# EAGLE design dpsv2 (EAGLE 6.4)
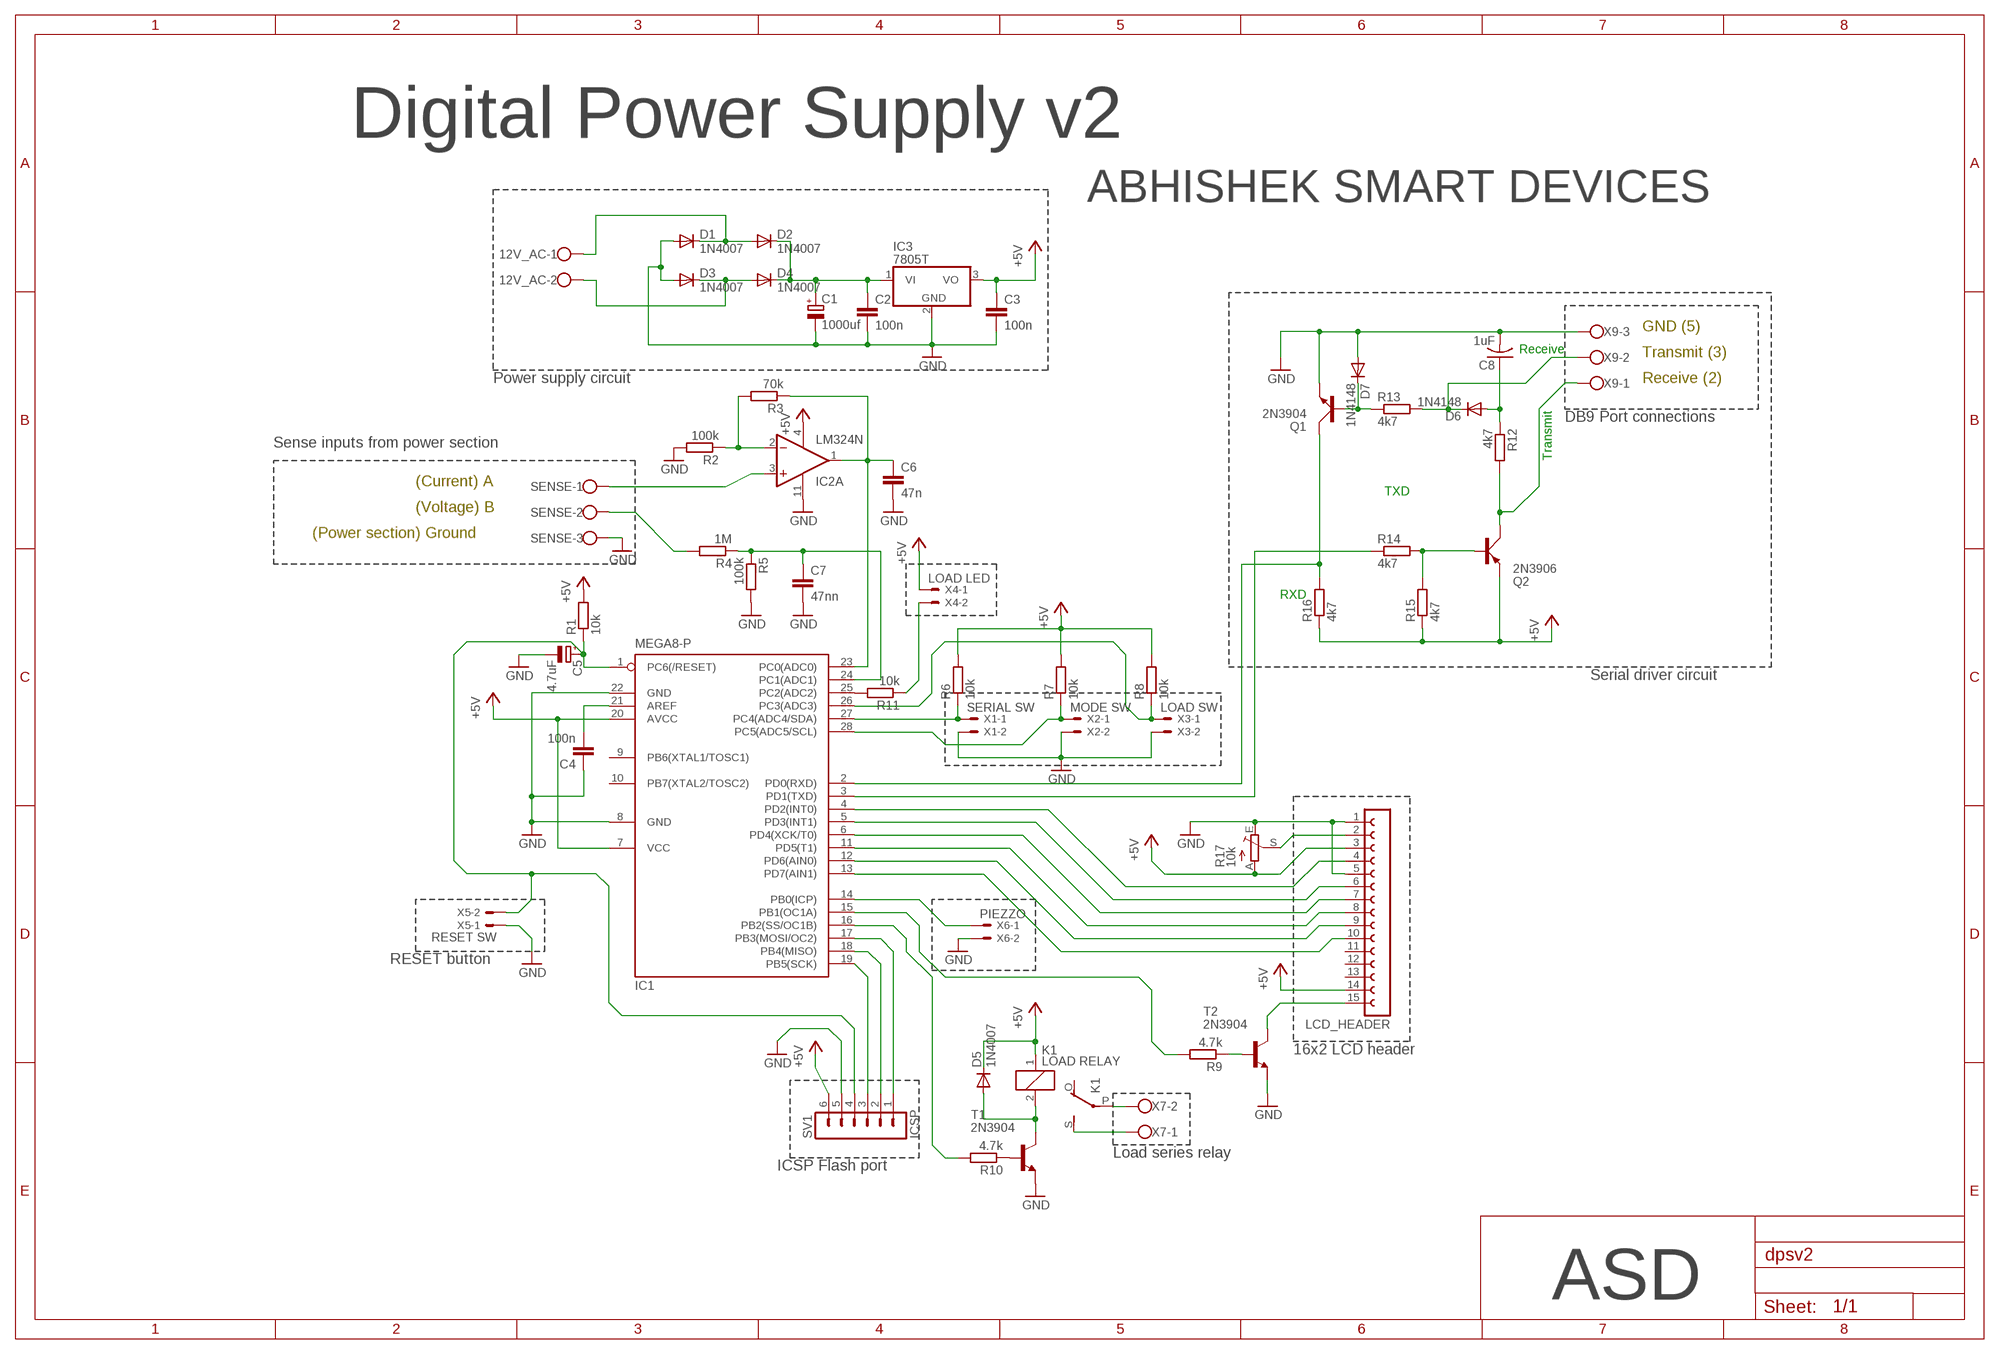
[diagram p0: schematic, sheet 1]

## Parts
12V_AC  W237-102  [W237-102]
C1  1000uf  CPOL-EUE5-13  [E5-13]
C2  100n  C-EU102-054X133  [C102-054X133]
C3  100n  C-EU102-054X133  [C102-054X133]
C4  100n  C-EU102-054X133  [C102-054X133]
C5  4.7uF  CPOL-EUE2.5-7  [E2,5-7]
C6  47n  C-EU050-025X075  [C050-025X075]
C7  47nn  C-EU050-025X075  [C050-025X075]
C8  1uF  C-US025-040X050  [C025-040X050]
D1  1N4007  DIODE-DO07  [DO07]
D2  1N4007  DIODE-DO07  [DO07]
D3  1N4007  DIODE-DO07  [DO07]
D4  1N4007  DIODE-DO07  [DO07]
D5  1N4007  DIODE-DO07  [DO07]
D6  1N4148  [DO35-10]
D7  1N4148  [DO35-10]
IC1  MEGA8-P  [DIL28-3]
IC2  LM324N  [DIL14]
IC3  7805T  [TO220H]
K1  LOAD RELAY  G5L  [G5LE]
LCD_HEADER  FE15-1  [FE15]
Q1  2N3904  [TO92D]
Q2  2N3906  [TO92D]
R1  10k  R-EU_0309/12  [0309/12]
R2  100k  R-EU_0309/12  [0309/12]
R3  70k  R-EU_0309/12  [0309/12]
R4  1M  R-EU_0309/12  [0309/12]
R5  100k  R-EU_0309/12  [0309/12]
R6  10k  R-EU_0309/12  [0309/12]
R7  10k  R-EU_0309/12  [0309/12]
R8  10k  R-EU_0309/12  [0309/12]
R9  4.7k  R-EU_0309/12  [0309/12]
R10  4.7k  R-EU_0309/12  [0309/12]
R11  10k  R-EU_0309/12  [0309/12]
R12  4k7  R-EU_0309/12  [0309/12]
R13  4k7  R-EU_0309/12  [0309/12]
R14  4k7  R-EU_0309/12  [0309/12]
R15  4k7  R-EU_0309/12  [0309/12]
R16  4k7  R-EU_0309/12  [0309/12]
R17  10k  TRIM_EU-B25X  [B25X]
SENSE  W237-103  [W237-103]
SV1  ICSP  MA06-1  [MA06-1]
T1  2N3904  BC548-NPN-TO92-CBE  [TO92-CBE]
T2  2N3904  BC548-NPN-TO92-CBE  [TO92-CBE]
X1  SERIAL SW  22-23-2021  [22-23-2021]
X2  MODE SW  22-23-2021  [22-23-2021]
X3  LOAD SW  22-23-2021  [22-23-2021]
X4  LOAD LED  22-23-2021  [22-23-2021]
X5  RESET SW  22-23-2021  [22-23-2021]
X6  PIEZZO  22-23-2021  [22-23-2021]
X7  W237-102  [W237-102]
X9  W237-103  [W237-103]

## Nets
+5V: C3.1 D5.C IC1.7(VCC) IC1.20(AVCC) IC2.4(P:V+) IC3.3(VO) K1.1 LCD_HEADER.3 LCD_HEADER.14 Q2.E R1.2 R6.2 R7.2 R8.2 R15.1 R16.1 R17.A SV1.6 X4.1
GND: C1.- C2.2 C3.2 C4.1 C5.- C6.2 C7.2 C8.2 D1.A D3.A D7.A IC1.8(GND) IC1.22(GND) IC2.11(P:V-) IC3.2(GND) LCD_HEADER.1 LCD_HEADER.5 Q1.E R2.2 R5.2 R17.E SENSE.3 SV1.5 T1.E T2.E X1.2 X2.2 X3.2 X5.1 X6.2 X9.3
N$1: C6.1 IC1.23(PC0(ADC0)) IC2.1(A:OUT) R3.1
N$2: 12V_AC.1 D1.C D2.A
N$3: 12V_AC.2 D3.C D4.A
N$4: C1.+ C2.1 D2.C D4.C IC3.1(VI)
N$5: IC2.3(A:+IN) SENSE.1
N$6: R4.2 SENSE.2
N$7: C4.2 IC1.21(AREF)
N$8: C7.1 IC1.24(PC1(ADC1)) R4.1 R5.1
N$9: C5.+ IC1.1(PC6(/RESET)) R1.1 SV1.4 X5.2
N$10: IC2.2(A:-IN) R2.1 R3.2
N$11: IC1.27(PC4(ADC4/SDA)) R6.1 X1.1
N$12: IC1.28(PC5(ADC5/SCL)) R7.1 X2.1
N$13: IC1.26(PC3(ADC3)) R8.1 X3.1
N$14: LCD_HEADER.15 T2.C
N$15: IC1.15(PB1(OC1A)) R9.2
N$16: IC1.16(PB2(SS/OC1B)) R10.2
N$17: R9.1 T2.B
N$18: R10.1 T1.B
N$19: D5.A K1.2 T1.C
N$20: IC1.14(PB0(ICP)) X6.1
N$21: K1.P(2:P) X7.2
N$22: IC1.25(PC2(ADC2)) R11.2
N$23: R11.1 X4.2
N$24: K1.S(2:S) X7.1
N$25: IC1.17(PB3(MOSI/OC2)) SV1.1
N$26: IC1.18(PB4(MISO)) SV1.2
N$27: IC1.19(PB5(SCK)) SV1.3
N$28: IC1.2(PD0(RXD)) Q1.C R16.2
N$29: Q2.B R14.2 R15.2
N$30: C8.1 D6.A R12.1
N$31: Q2.C R12.2 X9.1
N$32: D7.C Q1.B R13.1
N$33: D6.C R13.2 X9.2
N$34: IC1.5(PD3(INT1)) LCD_HEADER.6
N$35: IC1.3(PD1(TXD)) R14.1
N$36: LCD_HEADER.2 R17.S
N$37: IC1.6(PD4(XCK/T0)) LCD_HEADER.7
N$38: IC1.11(PD5(T1)) LCD_HEADER.8
N$39: IC1.12(PD6(AIN0)) LCD_HEADER.9
N$40: IC1.4(PD2(INT0)) LCD_HEADER.4
N$41: IC1.13(PD7(AIN1)) LCD_HEADER.10
Unconnected: IC1.9(PB6(XTAL1/TOSC1)) IC1.10(PB7(XTAL2/TOSC2)) IC2.5(B:+IN) IC2.6(B:-IN) IC2.7(B:OUT) IC2.8(C:OUT) IC2.9(C:-IN) IC2.10(C:+IN) IC2.12(D:+IN) IC2.13(D:-IN) IC2.14(D:OUT) K1.O(2:O) LCD_HEADER.11 LCD_HEADER.12 LCD_HEADER.13

## Notes on the sheet
- Digital Power Supply v2
- ABHISHEK SMART DEVICES
- GND (5)
- Receive
- Transmit (3)
- Power supply circuit | Receive (2)
- DB9 Port connections
- Sense inputs from power section
- Transmit
- (Current) A | TXD
- (Voltage) B
- (Power section) Ground
- RXD
- Serial driver circuit
- RESET button
- 16x2 LCD header
- Load series relay
- ICSP Flash port
- ASD

## Library data of the parts
12V_AC X7 = con-wago-500:W237-102: WAGO SCREW CLAMP; MPN: 237-102; OC_FARNELL: unknown; OC_NEWARK: 70K9898
C1 C5 = resistor:CPOL-EU: POLARIZED CAPACITOR, European symbol
C2-C4 C6 C7 = resistor:C-EU: CAPACITOR, European symbol
C8 = resistor:C-US: CAPACITOR, American symbol
D1-D5 = diode:DIODE-: DIODE
D6 D7 = diode:1N4148: DIODE high speed (Philips)
IC1 = atmel:MEGA8-P: MICROCONTROLLER 8 Kbytes FLASH, 1 kbytes SRAM, 512 bytes EEPROM, USART, 4-channel 10 bit ADC, 2-channel 8 bit ADC Pin compatible with Atmega48, ATMega88, ATMega168 Source: avr.lbr; OC_FARNELL: unknown; OC_NEWARK: unknown
IC2 = linear:LM324: OP AMP
IC3 = linear:78*: Positive VOLTAGE REGULATOR Source: http://cache.national.com/ds/LM/LM78L05.pdf http://www.fairchildsemi.com/ds/LM/LM7805.pdf
K1 = relay:G5L: RELAY 1 x switch, 10 A/120 V AC, 8 A/30 V ADC, Omron; OC_FARNELL: unknown; OC_NEWARK: unknown
LCD_HEADER = con-lsta:FE15-1: FEMALE HEADER; OC_FARNELL: unknown; OC_NEWARK: unknown
Q1 = transistor-small-signal:2N3904: NPN TRANSISTOR
Q2 = transistor-small-signal:2N3906: PNP TRANSISTOR
R1-R16 = resistor:R-EU_: RESISTOR, European symbol
R17 = pot:TRIM_EU-: POTENTIOMETER
SENSE X9 = con-wago-500:W237-103: WAGO SCREW CLAMP; MPN: 237-103; OC_FARNELL: unknown; OC_NEWARK: 18M7116
SV1 = con-lstb:MA06-1: PIN HEADER; OC_FARNELL: unknown; OC_NEWARK: unknown
T1 T2 = transistor:*-NPN-: NPN Transistror BF959 corrected 2008.03.06
X1-X6 = con-molex:22-23-2021: .100" (2.54mm) Center Header - 2 Pin; MF: MOLEX; MPN: 22-23-2021; OC_FARNELL: 1462926; OC_NEWARK: 25C3832

## Board
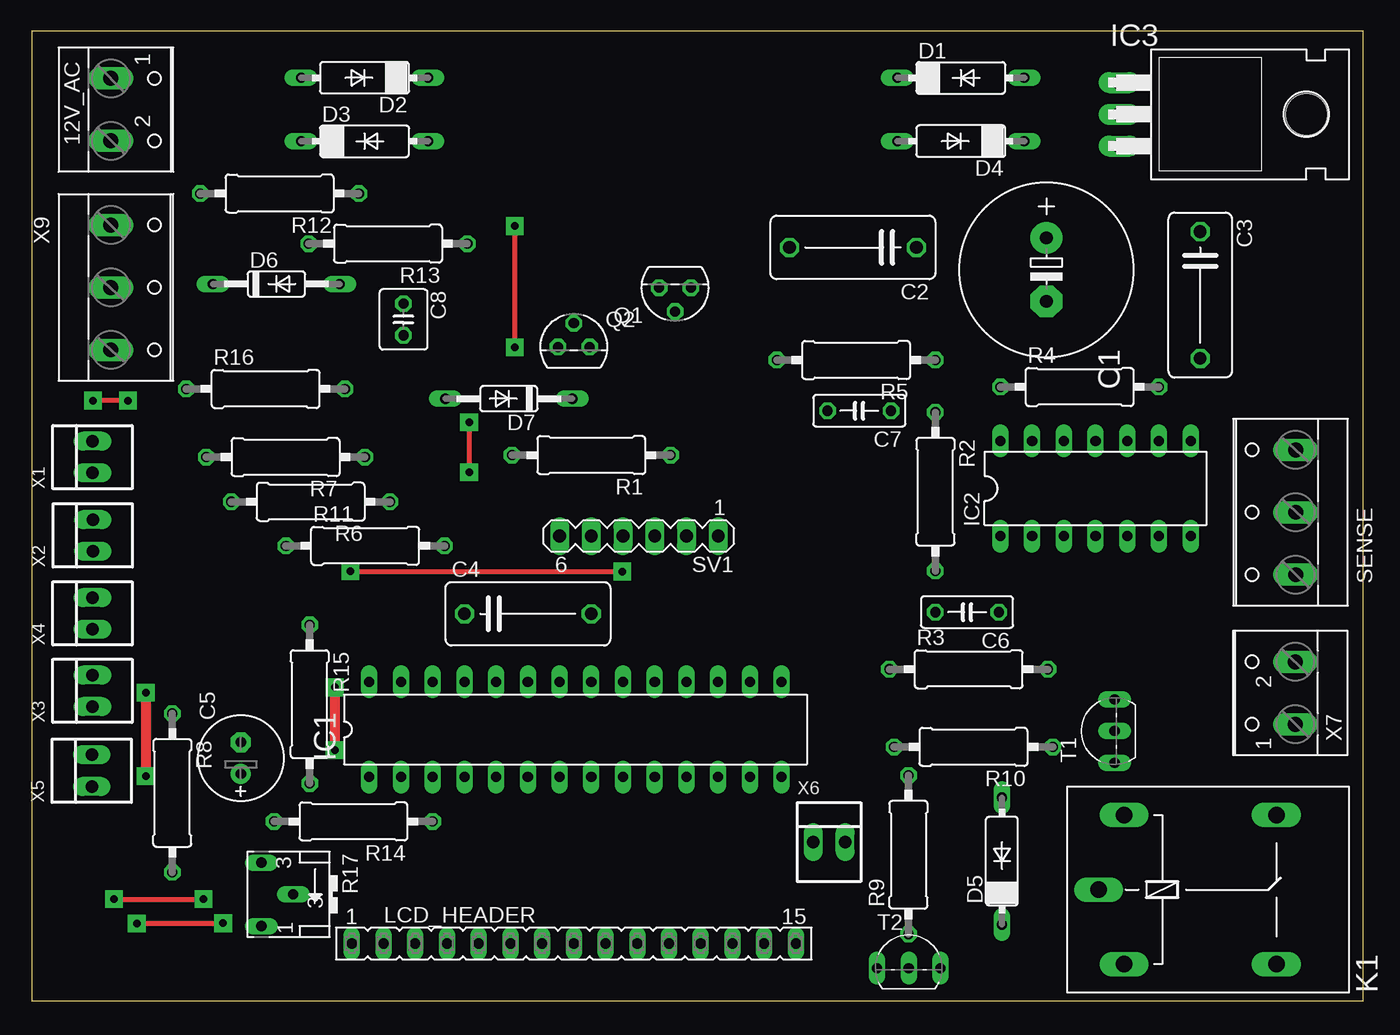
[diagram p1: board, top side]
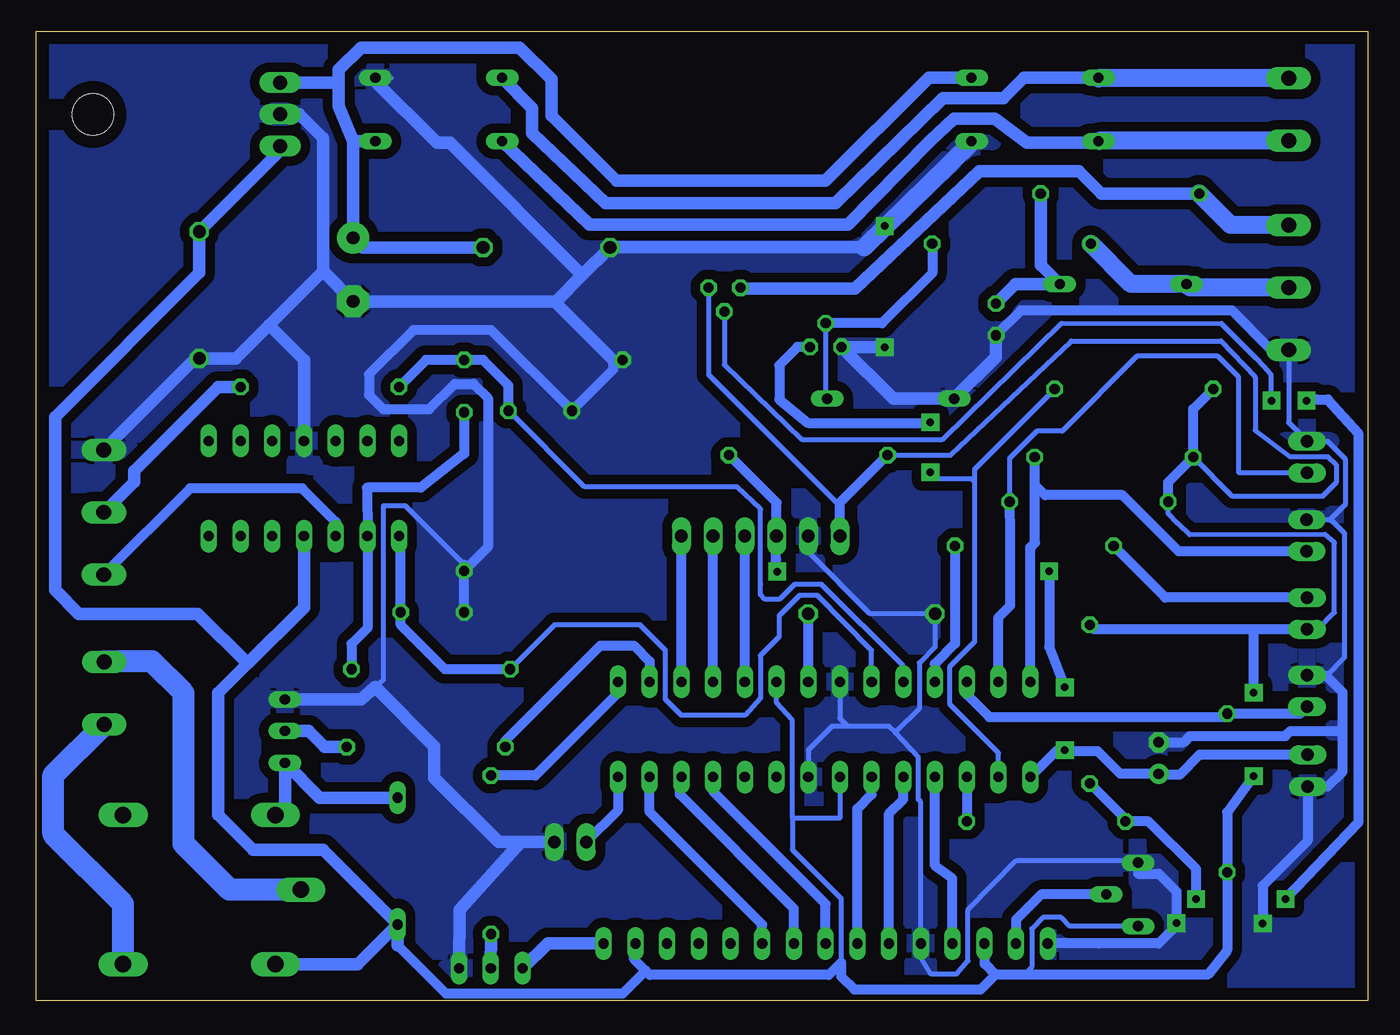
[diagram p2: board, bottom side, seen from below]

Size 106.66 x 77.65 mm. Coordinates in mm from the lower left corner, seen from the top.
Outline: 0,0 106.66,0 106.66,77.65 0,77.65 0,0
Copper layers (1*16): Top 0.035mm / dielectric 1.5mm / Bottom 0.035mm
Design rules "default *": minimum track width 10mil, minimum drill 24mil, track to track 30mil, track to pad 30mil, pad to pad 8mil, via to via 8mil, smd to smd 8mil, copper to edge 40mil, drill to drill 8mil, minimum pad ring 10mil, minimum via ring 8mil, stop-mask expansion 4mil, vias tented up to drill 0mil, thermal gap 10mil

### Footprints (pad centres in the part's own frame; a part is rotated, then mirrored left to right if it is on the bottom)
W237-102 = drill 1.194 long: 1 -2.5,-1.27; 2 2.5,-1.27
E5-13 = drill 1.016 pad 2.54: + -2.54,0 | drill 1.016 pad 2.54 octagon: - 2.54,0
C102-054X133 = drill 1.016 octagon: 1 -5.08,0; 2 5.08,0
E2,5-7 = drill 0.813 pad 1.6: + -1.27,0 | drill 0.813 pad 1.6 octagon: - 1.27,0
C050-025X075 = drill 0.813 octagon: 1 -2.54,0; 2 2.54,0
C025-040X050 = drill 0.813 octagon: 1 -1.27,0; 2 1.27,0
DO07 = drill 0.813 long: A 5.08,0; C -5.08,0
DO35-10 = drill 0.813 long: A 5.08,0; C -5.08,0
DIL28-3 = drill 0.813 long: 1 -16.51,-3.81; 2 -13.97,-3.81; 3 -11.43,-3.81; 4 -8.89,-3.81; 5 -6.35,-3.81; 6 -3.81,-3.81; 7 -1.27,-3.81; 8 1.27,-3.81; 9 3.81,-3.81; 10 6.35,-3.81; 11 8.89,-3.81; 12 11.43,-3.81; 13 13.97,-3.81; 14 16.51,-3.81; 15 16.51,3.81; 16 13.97,3.81; 17 11.43,3.81; 18 8.89,3.81; 19 6.35,3.81; 20 3.81,3.81; 21 1.27,3.81; 22 -1.27,3.81; 23 -3.81,3.81; 24 -6.35,3.81; 25 -8.89,3.81; 26 -11.43,3.81; 27 -13.97,3.81; 28 -16.51,3.81
DIL14 = drill 0.813 long: 1 -7.62,-3.81; 2 -5.08,-3.81; 3 -2.54,-3.81; 4 0,-3.81; 5 2.54,-3.81; 6 5.08,-3.81; 7 7.62,-3.81; 8 7.62,3.81; 9 5.08,3.81; 10 2.54,3.81; 11 0,3.81; 12 -2.54,3.81; 13 -5.08,3.81; 14 -7.62,3.81
TO220H = drill 1.118 long: 1 -2.54,-10.16; 2 0,-10.16; 3 2.54,-10.16 | hole 3.302: 0,4.826
G5LE = drill 1.321 long: 1 -7.493,-5.969; 2 -7.493,5.969; O 4.699,5.969; P -9.525,0; S 4.699,-5.969
FE15 = drill 0.813 long: 1 -17.78,0; 2 -15.24,0; 3 -12.7,0; 4 -10.16,0; 5 -7.62,0; 6 -5.08,0; 7 -2.54,0; 8 0,0; 9 2.54,0; 10 5.08,0; 11 7.62,0; 12 10.16,0; 13 12.7,0; 14 15.24,0; 15 17.78,0
TO92D = drill 0.813 octagon: B 0,1.905; C 1.27,0; E -1.27,0
0309/12 = drill 0.813 octagon: 1 -6.35,0; 2 6.35,0
B25X = drill 0.813 long: A 2.54,-1.905; E -2.54,-1.905; S 0,0.635
W237-103 = drill 1.194 long: 1 -5,-1.29; 2 0,-1.29; 3 5,-1.29
MA06-1 = drill 1.016 long: 1 -6.35,0; 2 -3.81,0; 3 -1.27,0; 4 1.27,0; 5 3.81,0; 6 6.35,0
TO92-CBE = drill 0.813 long: B 0,0; C -2.54,0; E 2.54,0
22-23-2021 = drill 1 long: 1 -1.27,0; 2 1.27,0

### Placement (x,y rotation side)
12V_AC  7.62,71.37 270 top
C1  81.28,58.55 270 top
C2  65.79,60.33 180 top
C3  93.6,56.52 270 top
C4  39.75,30.99 0 top
C5  16.76,19.43 90 top
C6  74.93,31.12 180 top
C7  66.29,47.24 180 top
C8  29.79,54.56 270 top
D1  74.42,73.91 0 top
D2  26.67,73.91 180 top
D3  26.67,68.83 0 top
D4  74.42,68.83 180 top
D5  77.72,11.18 90 top
D6  19.61,57.4 0 top
D7  38.23,48.21 180 top
IC1  43.56,21.72 0 top
IC2  85.22,41.02 0 top
IC3  97.28,70.99 270 top
K1  95,8.89 0 top
LCD_HEADER  43.43,4.57 0 top
Q1  43.43,52.35 0 top
Q2  51.54,57.1 180 top
R1  44.83,43.69 180 top
R2  72.39,40.77 270 top
R3  75.06,26.54 0 top
R4  83.95,49.15 0 top
R5  66.04,51.31 180 top
R6  22.35,39.95 180 top
R7  20.35,43.54 180 top
R8  11.28,16.64 270 top
R9  70.23,11.68 90 top
R10  75.44,20.32 180 top
R11  26.72,36.42 0 top
R12  19.86,64.64 180 top
R13  28.55,60.63 180 top
R14  25.78,14.35 180 top
R15  22.28,23.75 270 top
R16  18.75,49 0 top
R17  20.32,8.51 270 top
SENSE  99.95,39.12 90 top
SV1  48.64,37.21 180 top
T1  86.74,21.59 90 top
T2  70.26,2.59 0 top
X1  4.88,43.54 90 top
X2  4.9,37.26 90 top
X3  4.88,24.82 90 top
X4  4.88,31.01 90 top
X5  4.83,18.41 90 top
X6  63.88,12.7 0 top
X7  99.95,24.64 90 top
X9  7.65,57.12 270 top

### Tracks (layer width: path | path; a pad name or v marks a point on that pad's centre or on a via)
+5V  (via drill 0.6 pad 1.42)
  Top 0.813: v9.14,24.66 v9.14,17.98
  Bottom 0.406: IC3.3 87.12,68.07 | IC1.7 42.29,14.61 46.1,14.61 | 46.1,14.61 46.1,22.48 47.37,23.88 IC1.20 | 42.29,39.88 42.29,39.62 52.81,50.14 Q2.E | 21.92,29.74 R15.1 | X4.1 4.04,29.74 2.69,31.09 2.69,36.68 3.45,37.34 14.27,37.31 15.21,38.23 16,39.01 R6.2 | R1.2 33.43,43.69 23.77,52.83 11.79,52.83 9.04,49.94 9.04,45.67 6.25,43.56 3.2,43.56 2.54,42.93 2.54,41.5 3.66,40.39 10.85,40.39 R7.2 | 30.68,4.52 LCD_HEADER.3 | R17.A 23.88,5.97 24.56,6.66 26.03,6.66 26.92,5.77 26.92,2.69 27.53,2.08 | 46.1,14.61 46.1,12.09 42.19,8.18 42.19,3.05 | 58.78,4.47 LCD_HEADER.14
  Bottom 0.813: SV1.6 42.29,39.62 | 42.29,39.88 R1.2 | R16.1 13.99,47.4 R7.2 16,41.53 R6.2 | X4.1 9.14,29.74 | 9.14,29.74 21.92,29.74 | v9.14,17.98 11.28,15.09 R8.2 11.28,4.04 12.83,2.08 27.53,2.08 29.82,2.08 | v9.14,24.66 9.14,29.74 | 30.68,4.52 30.68,2.95 29.82,2.08 | 57.85,2.4 57.51,2.06 43.18,2.06 42.19,3.05 42.19,1.93 41.15,0.89 31.01,0.89 29.82,2.08 | 57.85,2.4 58.78,3.33 58.78,4.47 | 77.72,4.45 73.86,0.58 59.66,0.58 57.85,2.4
  Bottom 1.016: 87.12,68.07 C3.1 93.6,58.29 105.16,46.74 105.16,32.89 103.25,30.99 93.73,30.99 89.73,26.99 | IC2.4 85.22,31.5 89.73,26.99 | 89.73,26.99 92.07,24.64 92.07,14.86 89.28,12.06 83.69,12.06 D5.C | K1.1 80.9,2.92 D5.C | D5.C 77.72,4.45
GND  (via drill 0.6 pad 1.42)
  Top 0.406: v8.43,6.17 v15.34,6.2 | v38.71,52.32 v38.71,62.04
  Bottom 0.406: 78.23,73.91 D1.A 79.5,73.66 | 65.15,56.01 65.02,56.01 | C3.2 93.92,51.44 | R5.2 60.45,51.31 | C6.2 R2.2 | 72.39,34.93 77.09,39.62 78.87,39.62 78.87,25.65 79.5,25.11 | 37.85,21.46 36.02,19.53 36.02,16.1 35.81,15.9 LCD_HEADER.5 35.81,3.4 35.05,2.16 32.92,2.16 32.03,3.17 32.03,7.29 28.14,11.23 18.59,11.23 R17.E | 37.85,21.46 38.35,21.97 41.66,21.97 | 41.66,21.97 42.93,21.97 44.83,20.07 IC1.8 | IC1.22 42.29,22.61 41.66,21.97 | SV1.5 44.83,35.94 39.88,30.99 C4.1 34.67,28.32 35.94,27.05 35.94,23.37 37.85,21.46 | 4.8,26.01 X3.2 | 3.05,38.51 1.83,39.73 1.83,43.38 3.25,44.81 X1.2 6.35,46.28 X9.3 | 3.05,38.51 4.88,38.51 X2.2 | 21.49,4.52 21.54,4.57 | 3.05,38.51 2.95,38.51 1.88,37.44 1.88,27.48 3.35,26.01 | 2.34,21.59 2.03,21.9 | D3.A 31.75,68.73 | 60.53,60.35 C2.2 | 38.84,52.35 v38.71,52.32 | 38.56,62.09 v38.71,62.04 39.63,61.11 39.73,61.11 40.34,60.5 40.34,60.35 | v15.34,6.2 15.34,5.99
  Bottom 0.813: 60.45,51.31 60.45,50.55 C7.2 70.23,53.72 76.45,53.72 80.01,50.16 80.01,48.51 78.87,47.37 75.18,47.37 73.15,49.4 71.63,49.4 70.48,48.26 70.48,36.32 R2.2 | C6.2 72.39,34.93 | R17.E 18.41,10.16 16.76,10.16 15.34,8.74 v15.34,6.2 | LCD_HEADER.1 21.54,4.57 16.76,4.57 15.34,5.99 | 4.8,26.01 3.35,26.01 2.03,24.69 2.03,21.9 2.03,18.34 3.23,17.15 X5.1 4.83,12.8 8.43,9.2 v8.43,6.17 | C5.- 14.76,20.7 14.27,21.18 6.6,21.18 6.2,21.59 2.34,21.59 | X9.3 7.72,52.12 10.87,55.27 27.81,55.27 C8.2
  Bottom 1.016: IC3.2 85.6,70.99 83.69,69.09 83.69,58.42 | 83.69,58.42 C1.- 65.15,56.01 60.45,51.31 | 65.02,56.01 62.93,58.1 | 62.93,58.1 C2.2 | 79.5,73.66 74.55,68.71 73.53,68.71 62.93,58.1 | C3.2 90.68,51.44 88.01,54.1 | 88.01,54.1 83.69,58.42 | 93.92,51.44 SENSE.3 | X6.2 67.82,12.7 | 67.82,12.7 72.77,7.26 T2.E | IC2.11 85.22,51.31 88.01,54.1 | T1.E 80.64,24.13 79.5,25.11 74.78,20.38 74.78,17.83 69.65,12.7 67.82,12.7 | 40.34,60.35 60.53,60.35 | C8.2 29.79,51.56 D7.A 38.02,48.21 Q1.E 38.84,52.35
  Bottom 1.422: 31.75,68.73 40.34,60.35
  pour Bottom: -1.02,78.13 -1.02,-0.61 -0.33,-1.3 107.26,-1.3 108.92,0.36 108.92,77.32 106.73,79.5 0.36,79.5 -0.97,78.18
N$1
  Bottom 0.406: 77.47,37.08 IC2.1 | IC1.23 39.75,28.07 44.09,32.46 45.52,32.46 47.17,30.81 47.17,29.13 48.67,27.63 48.67,24.28 48.64,24.26 49.91,22.86 54.99,22.86 56.26,24.13 56.26,28.07 58.29,30.1 65.15,30.1 R3.1
  Bottom 0.813: 77.47,37.08 C6.1 77.47,30.1 73.91,26.54 R3.1
N$2
  Bottom 0.406: 21.59,73.87 D2.A
  Bottom 1.016: D2.A 27.56,73.91 29.21,72.26 34.04,72.26 42.65,63.88 61.06,63.88 66.93,69.47 66.93,71.5 D1.C
  Bottom 1.422: 12V_AC.1 21.59,73.87
N$3
  Bottom 0.406: 21.55,68.87 D3.C 21.72,68.71
  Bottom 1.016: 21.72,68.71 27.3,68.71 29.9,70.64 33.17,70.64 35.03,68.86 37.39,66.5 41.63,62.15 62.33,62.15 D4.A
  Bottom 1.422: 12V_AC.2 21.55,68.87
N$4
  Bottom 0.406: 82.55,73.53 82.42,73.66
  Bottom 1.016: 81.28,68.83 82.42,71.63 82.42,73.66 82.42,74.55 80.64,76.33 67.94,76.33 65.41,73.79 65.41,70.87 60.2,65.66 43.43,65.66 35.18,73.91 D2.C | 81.28,68.83 D4.C | IC3.1 82.55,73.53 | 81.28,68.83 C1.+ 80.52,60.33 C2.1
N$5
  Bottom 0.813: IC2.3 82.68,38.35 85.34,41.02 94.33,41.02 SENSE.1
N$6
  Bottom 1.016: R4.2 92.07,49.15 98.81,42.42 98.81,41.55 SENSE.2
N$7
  Bottom 0.813: IC1.21 C4.2
N$8
  Bottom 0.406: IC1.24 37.21,26.8 43.76,33.35 45.92,33.35 47.14,32.13 48.29,32.13 48.67,32.51 48.67,33.33 48.64,33.35 48.64,39.37 50.55,41.15 62.74,41.15 C7.1
  Bottom 0.813: R4.1 75.44,51.31 R5.1 70.87,51.31 68.83,49.28 C7.1
N$9  (via drill 0.6 pad 1.42)
  Top 0.406: v25.53,34.39 v47.32,34.37
  Top 0.813: v24.28,25.09 v24.28,20.07
  Bottom 0.406: 19.84,18.16 C5.+ 16.69,18.09 | 47.4,37.19 SV1.4 | v24.28,20.07 24.38,19.96
  Bottom 0.813: SV1.4 47.37,39.88 R1.1 | 19.84,18.16 21.64,19.96 24.38,19.96 24.99,19.96 IC1.1 | X5.2 13.49,19.69 15.09,18.09 16.69,18.09 | C5.+ 19.79,18.16 | v47.32,34.37 47.4,35.31 47.4,37.19 | v25.53,34.39 25.53,28.3 v24.28,25.09
N$10
  Bottom 0.813: R2.1 72.39,43.82 75.84,41.1 80.16,41.1 IC2.2 80.14,29.84 81.41,28.58 R3.2
N$11
  Bottom 0.406: X1.1 10.34,42.27 10.36,49.94 12.04,51.61 18.49,51.61 24.49,45.62 26.52,45.62 28.7,43.43 R6.1
  Bottom 0.813: IC1.27 29.59,30.71 28.65,31.65 28.65,38.18 R6.1
N$12
  Bottom 0.406: 26.67,43.51 R7.1
  Bottom 0.813: IC1.28 27.05,36.3 26.67,36.68 26.67,41.3 | 26.67,41.3 26.67,43.51 | X2.1 15.16,35.99 19.66,40.49 25.86,40.49 26.67,41.3
N$13
  Bottom 0.406: 11.2,22.71 R8.1
  Bottom 0.813: R8.1 5.44,22.99 X3.1 | IC1.26 32.13,24.51 30.33,22.71 11.2,22.71
N$14
  Bottom 1.016: LCD_HEADER.15 65.66,4.57 T2.C
N$15
  Bottom 0.813: IC1.15 60.07,24.64 66.67,18.03 R9.2
N$16
  Bottom 0.406: R10.2 69.09,20.83
  Bottom 0.813: 69.09,20.83 61.47,28.45 58.8,28.45 57.53,27.18 IC1.16
N$17
  Bottom 1.016: T2.B R9.1
N$18
  Bottom 1.016: R10.1 83.57,20.32 84.84,21.59 T1.B
N$19
  Bottom 1.016: K1.2 86.74,15.62 T1.C 83.95,16.26 D5.A
N$20
  Bottom 0.813: IC1.14 60.07,15.24 X6.1
N$21
  Bottom 0.406: 101.18,27.18 X7.2
  Bottom 1.778: K1.P 91.19,8.89 94.87,12.57 94.87,24.64 97.41,27.18 101.18,27.18
N$22
  Bottom 0.406: 34.7,25.55 IC1.25
  Bottom 0.813: R11.2 33.07,28.6 34.7,26.98 34.7,25.55
N$23
  Bottom 0.813: X4.2 16.23,32.28 R11.1
N$24
  Bottom 1.778: K1.S 99.69,7.75 105.28,13.34 105.28,18.07 X7.1
N$25
  Bottom 0.813: IC1.17 SV1.1
N$26
  Bottom 0.813: IC1.18 SV1.2
N$27
  Bottom 0.813: IC1.19 SV1.3
N$28  (via drill 0.6 pad 1.42)
  Top 0.406: v35.05,46.33 v35.05,42.32
  Bottom 0.406: IC1.2 29.59,19.84 33.48,23.72 33.48,26.77 31.5,28.75 31.5,41.55 | 31.5,41.55 31.5,42.6 R16.2 | 35.61,46.28 v35.05,46.33 | v35.05,42.32 34.54,41.81 31.75,41.81 31.5,41.55
  Bottom 0.813: Q1.C 45.7,52.35 47.14,50.9 47.14,48.16 44.86,46.28 35.61,46.28
N$29  (via drill 0.6 pad 1.42)
  Top 0.406: v7.72,48.06 v4.93,48.06 | v6.6,8.13 v13.77,8.13
  Bottom 0.406: R14.2 19.43,14.55 | Q2.B 51.54,50.93 45.31,44.96 34.09,44.96 24.54,54.25 11.73,54.23 8.99,51.49 8.38,50.83 7.77,50.14 7.77,48.11 v7.72,48.06 | v4.93,48.06 4.12,48.16
  Bottom 0.813: 19.43,14.55 R15.2 | 4.12,48.16 3.2,48.16 0.79,45.47 0.79,14.22 v6.6,8.13 | v13.77,8.13 13.77,10.54 17.58,14.35 R14.2
N$30
  Bottom 1.016: R12.1 26.21,58.93 D6.A 28.22,57.4 C8.1
N$31
  Bottom 0.406: 50.22,57.05 Q2.C
  Bottom 1.016: 50.22,57.05 41.07,57.05 31.14,66.45 23.14,66.45 21.34,64.64 R12.2
  Bottom 1.422: X9.1 10.99,62.12 R12.2
N$32
  Bottom 0.406: Q1.B 43.43,48.34 D7.C
  Bottom 0.813: R13.1 34.9,58.27 38.91,54.25 Q1.B
N$33
  Bottom 1.422: X9.2 14.25,57.12 D6.C 18.97,57.4 R13.2
N$34
  Bottom 0.813: LCD_HEADER.6 38.35,14.99 37.21,16.13 IC1.5
N$35
  Bottom 0.813: IC1.3 R14.1
N$36
  Bottom 0.813: R17.S 26.16,8.51 28.19,6.48 LCD_HEADER.2
N$37
  Bottom 0.813: LCD_HEADER.7 40.89,15.37 39.75,16.51 IC1.6
N$38
  Bottom 0.813: LCD_HEADER.8 43.43,7.75 52.45,16.76 IC1.11
N$39
  Bottom 0.406: 55.12,17.78 IC1.12
  Bottom 0.813: LCD_HEADER.9 45.97,7.37 55.12,16.51 55.12,17.78
N$40
  Bottom 0.813: LCD_HEADER.4 33.3,9.78 34.67,10.79 IC1.4
N$41
  Bottom 0.813: LCD_HEADER.10 48.51,6.1 57.53,15.11 IC1.13